# Altium schematic sheet ADC_AH.SchDoc
size A4; CompanyName: Technische Hochschule Nürnberg Georg Simon Ohm; Organization: UltraZohm; Address1: Kesslerplatz 12; Address2: 90489 Nürnberg; Address3: GERMANY; DocumentNumber: 4; SheetNumber: 4; SheetTotal: 12; Website: www.ultrazohm.com
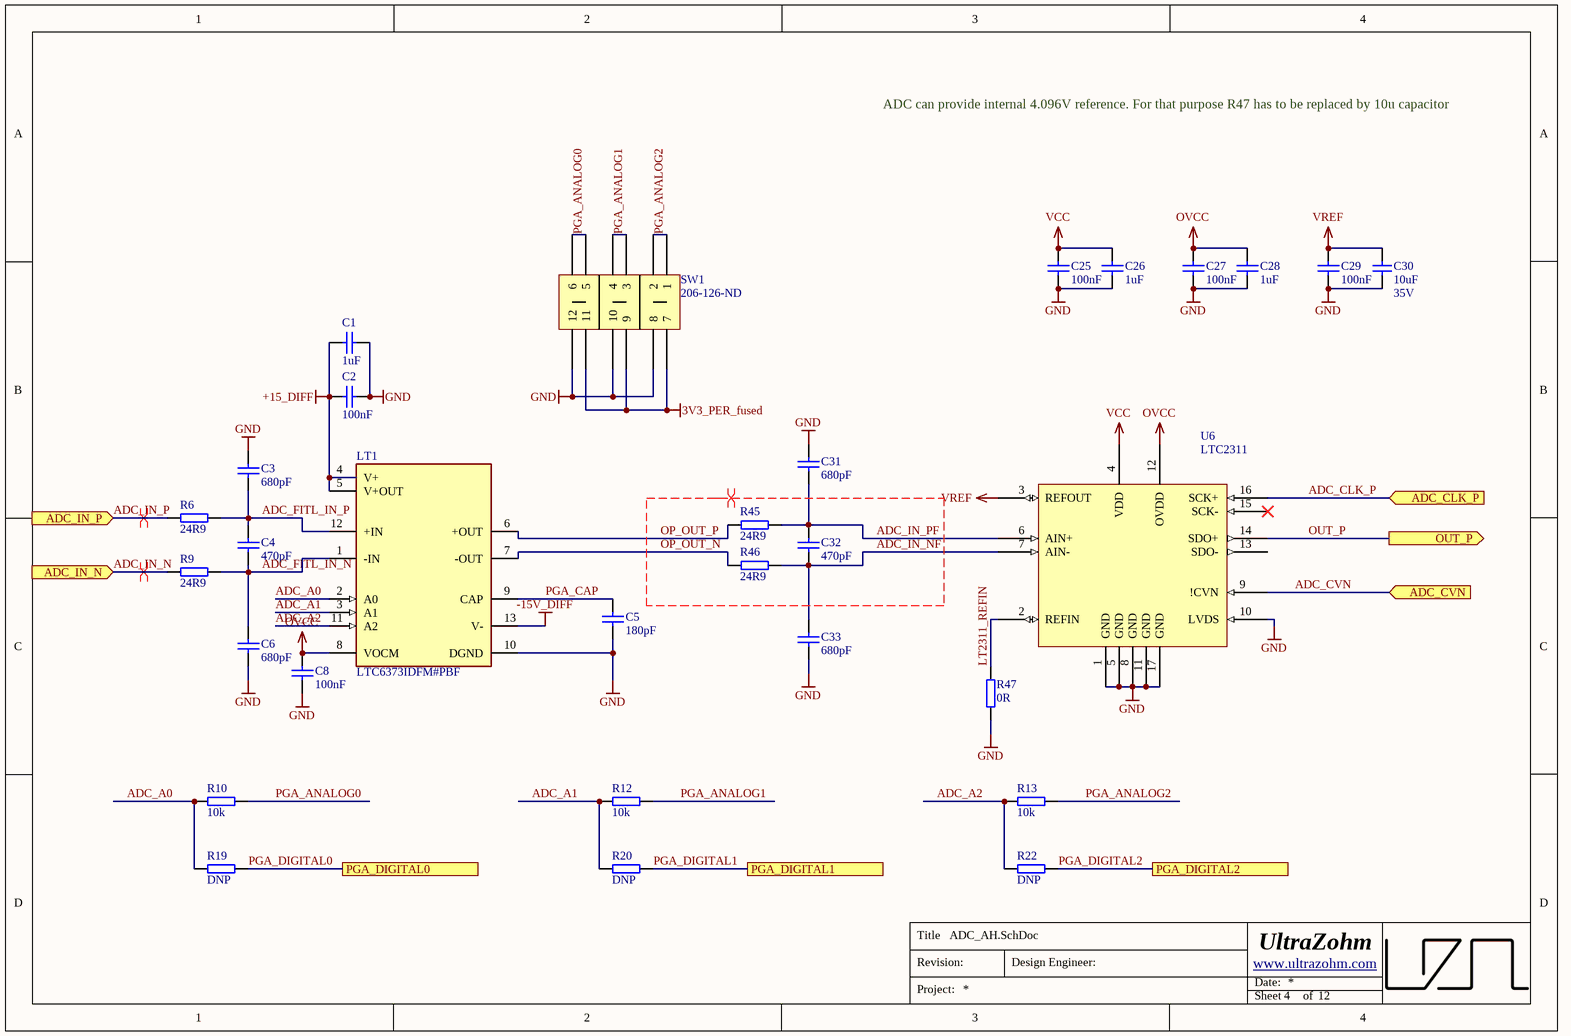
[diagram p0: ADC_AH.SchDoc]

## Parts
C1  1uF  [CAPC1608X07N]
C2  100nF  [CAPC1608X07N]
C3  680pF  [CAPC1608X07N]
C4  470pF  [CAPC1608X07N]
C5  180pF  [CAPC1608X07N]
C6  680pF  [CAPC1608X07N]
C8  100nF  [CAPC1608X07N]
C25  100nF  [CAPC1608X07N]
C26  1uF  [CAPC1608X07N]
C27  100nF  [CAPC1608X07N]
C28  1uF  [CAPC1608X07N]
C29  100nF  [CAPC1608X07N]
C30  10uF  Voltage: 35V  [C_1206]
C31  680pF  [CAPC1608X07N]
C32  470pF  [CAPC1608X07N]
C33  680pF  [CAPC1608X07N]
LT1  LTC6373IDFM#PBF  [FP-LTC6373IDFM#PBF-MFG]
R6  24R9  [RESC1608X06N]
R9  24R9  [RESC1608X06N]
R10  10k  [RESC1608X06N]
R12  10k  [RESC1608X06N]
R13  10k  [RESC1608X06N]
R19  DNP  [RESC1608X06N]
R20  DNP  [RESC1608X06N]
R22  DNP  [RESC1608X06N]
R45  24R9  [RESC1608X06N]
R46  24R9  [RESC1608X06N]
R47  0R  [RESC1608X06N]
SW1  Supplier Part Number 1: 206-126-ND  [206-123]  (hidden comment: 206-126)
U6  LTC2311  [LTC2311-16]

## Ports
ADC_CLK_P (in), ADC_CVN (in), ADC_IN_N (in), ADC_IN_P (in), OUT_P (out), PGA_DIGITAL0, PGA_DIGITAL1, PGA_DIGITAL2

## Nets
3V3_PER_fused: SW1.7 SW1.9 SW1.11
+15_DIFF: C1.1 C2.1 LT1.4(V+) LT1.5(V+OUT)
-15V_DIFF: LT1.13(V-)
GND: C1.2 C2.2 C3.1 C5.2 C6.2 C8.2 C25.2 C26.1 C27.2 C28.1 C29.2 C30.1 C31.1 C33.2 LT1.10(DGND) R47.1 SW1.8 SW1.10 SW1.12 U6.1(GND) U6.5(GND) U6.8(GND) U6.10(LVDS) U6.11(GND) U6.17(GND)
OVCC: C8.1 C27.1 C28.2 LT1.8(VOCM) U6.12(OVDD)
VCC: C25.1 C26.2 U6.4(VDD)
VREF: C29.1 C30.2 U6.3(REFOUT)
ADC_A0: LT1.2(A0) R10.2 R19.2
ADC_A1: LT1.3(A1) R12.2 R20.2
ADC_A2: LT1.11(A2) R13.2 R22.2
ADC_CLK_P: U6.16(SCK+) ; port ADC_CLK_P
ADC_CVN: U6.9(!CVN) ; port ADC_CVN
ADC_FITL_IN_N: C4.2 C6.1 LT1.1(-IN) R9.2
ADC_FITL_IN_P: C3.2 C4.1 LT1.12(+IN) R6.2
ADC_IN_N: R9.1 ; port ADC_IN_N
ADC_IN_NF: C32.2 C33.1 R46.2 U6.7(AIN-)
ADC_IN_P: R6.1 ; port ADC_IN_P
ADC_IN_PF: C31.2 C32.1 R45.2 U6.6(AIN+)
LT2311_REFIN: R47.2 U6.2(REFIN)
OP_OUT_N: LT1.7(-OUT) R46.1
OP_OUT_P: LT1.6(+OUT) R45.1
OUT_P: U6.14(SDO+) ; port OUT_P
PGA_ANALOG0: R10.1 SW1.5 SW1.6
PGA_ANALOG1: R12.1 SW1.3 SW1.4
PGA_ANALOG2: R13.1 SW1.1 SW1.2
PGA_CAP: C5.1 LT1.9(CAP)
PGA_DIGITAL0: R19.1 ; port PGA_DIGITAL0
PGA_DIGITAL1: R20.1 ; port PGA_DIGITAL1
PGA_DIGITAL2: R22.1 ; port PGA_DIGITAL2

Not connected (* = marked no-connect by the designer): U6 13(SDO-) 15(SCK-)*

## Layout directives
differential pair: ADC_IN_N, ADC_IN_NF, ADC_IN_P, ADC_IN_PF, OP_OUT_N, OP_OUT_P

## Notes on the sheet
- ADC can provide internal 4.096V reference. For that purpose R47 has to be replaced by 10u capacitor
- Title
- Revision:
- Design Engineer:
- Date:
- Project:
- Sheet
- of

## Library data of the parts
C1 C26 C28 = Cap_0603: MPN: C0603C105K3R; Voltage: 25V; Value: 1uF
C2 C8 C25 C27 C29 = Cap_0603: MPN: 885012206071; MF: Würth; Voltage: 25V; Value: 100nF; Supplier 1: Mouser; Supplier 2: *; Supplier Part Number 1: 710-885012206071; Supplier Part Number 2: *
C3 C5 C6 C31 C33 = Cap_0603: MPN: VJ0603A681GXJCW1BC; MF: Vishay; Voltage: 16V; Supplier 1: Mouser; Supplier 2: *; Supplier Part Number 1: 77-VJ0603A681GXJCBC; Supplier Part Number 2: *
  C3 C6 C31 C33: Value: 680pF
  C5: Value: 180pF
C4 C32 = Cap_0603: MPN: VJ0603A471GXJPW1BC; MF: Vishay; Voltage: 16V; Value: 470pF; Supplier 1: Mouser; Supplier 2: *; Supplier Part Number 1: 77-VJ0603A471GXJPBC; Supplier Part Number 2: *
C30 = C_1206: Capacitor 1206; MPN: GRM319R6YA106KA12D; Tolerance: 10%; MF: Murata Electronics; Dielectric: X5R; Package: 1206; Value: 10uF; Created: 2018_06_25_AGeiger; Supplier 1: Mouser; Supplier Part Number 1: 81-GRM319R6YA106KA2D
LT1 = CMP-09116-000044-1: INST Amp Single ±18V 12-Pin DFN EP Tube; RoHS Compliant: Yes
R6 R9 R45 R46 = R_0603: MPN: RC0603FR-0724R9L; MF: Yageo; Value: 24R9; Supplier 1: Mouser; Supplier Part Number 1: 603-RC0603FR-0724R9L
R10 R12 R13 R19 R20 R22 R47 = R_0603: MPN: CRCW06030000Z0EAC; MF: Vishay; Supplier 1: Mouser; Supplier Part Number 1: 71-CRCW06030000Z0EAC
  R10 R12 R13: Value: 10k
  R19 R20 R22: Value: DNP
  R47: Value: 0R
SW1 = 206-126: Switch DIP OFF ON SPDT 6 Raised Slide 0.05A 24VDC PC Pins 2.54mm Thru-Hole Tube; Manufacturer: CTS; Body Material: Plastic; Voltage Rating (DC): 24V; Number of Positions: 6; Current Rating: 50mA; Electrical Life: 10000Cycles; Actuator Type: Slide (Standard); Pitch: 0.1inch; Washable: No; Supplier 1: Digi-Key; Manufacturer Part Number: 206-126; RoHS: Yes; Category: DIP Switches; Pricing 1: 1005=1,10898 (USD); Mount: Through Hole; Contact Plating: Gold; Min Operating Temperature: -55°C; Max Operating Temperature: 85°C; Packaging: Rail/Tube; Termination: PC Pin; Package Quantity: 15; Throw Configuration: SPDT; Series: 206; Max Voltage Rating (DC): 24V; Length: 1.286inch; Terminal Pitch: 2.54mm; Radiation Hardening: No; RoHS Compliant: Yes; ComponentLink1URL: https://datasheet.ciiva.com/8677/206-208-8677008.pdf?src-supplier=Avnet; ComponentLink1Description: https://datasheet.ciiva.com/8677/206-208-8677008.pdf?src-supplier=Avnet; ComponentLink2URL: https://datasheet.ciiva.com/12451/206-208-11732-12451385.pdf?src-supplier=Mouser; ComponentLink2Description: https://datasheet.ciiva.com/12451/206-208-11732-12451385.pdf?src-supplier=Mouser
U6 = LTC2311-16: 16 Bit SAR ADC, 5MSps; MPN: LTC2311CMSE-16#PBF; MF: Analog Devices; Package: MSOP-16; Supplier 1: Mouser; Supplier 2: Digi-Key; Supplier Part Number 1: 584-C2311CMSE-16PBF; Supplier Part Number 2: LTC2311CMSE-16#PBF-ND